# EAGLE design countdown timer (EAGLE 5.06)
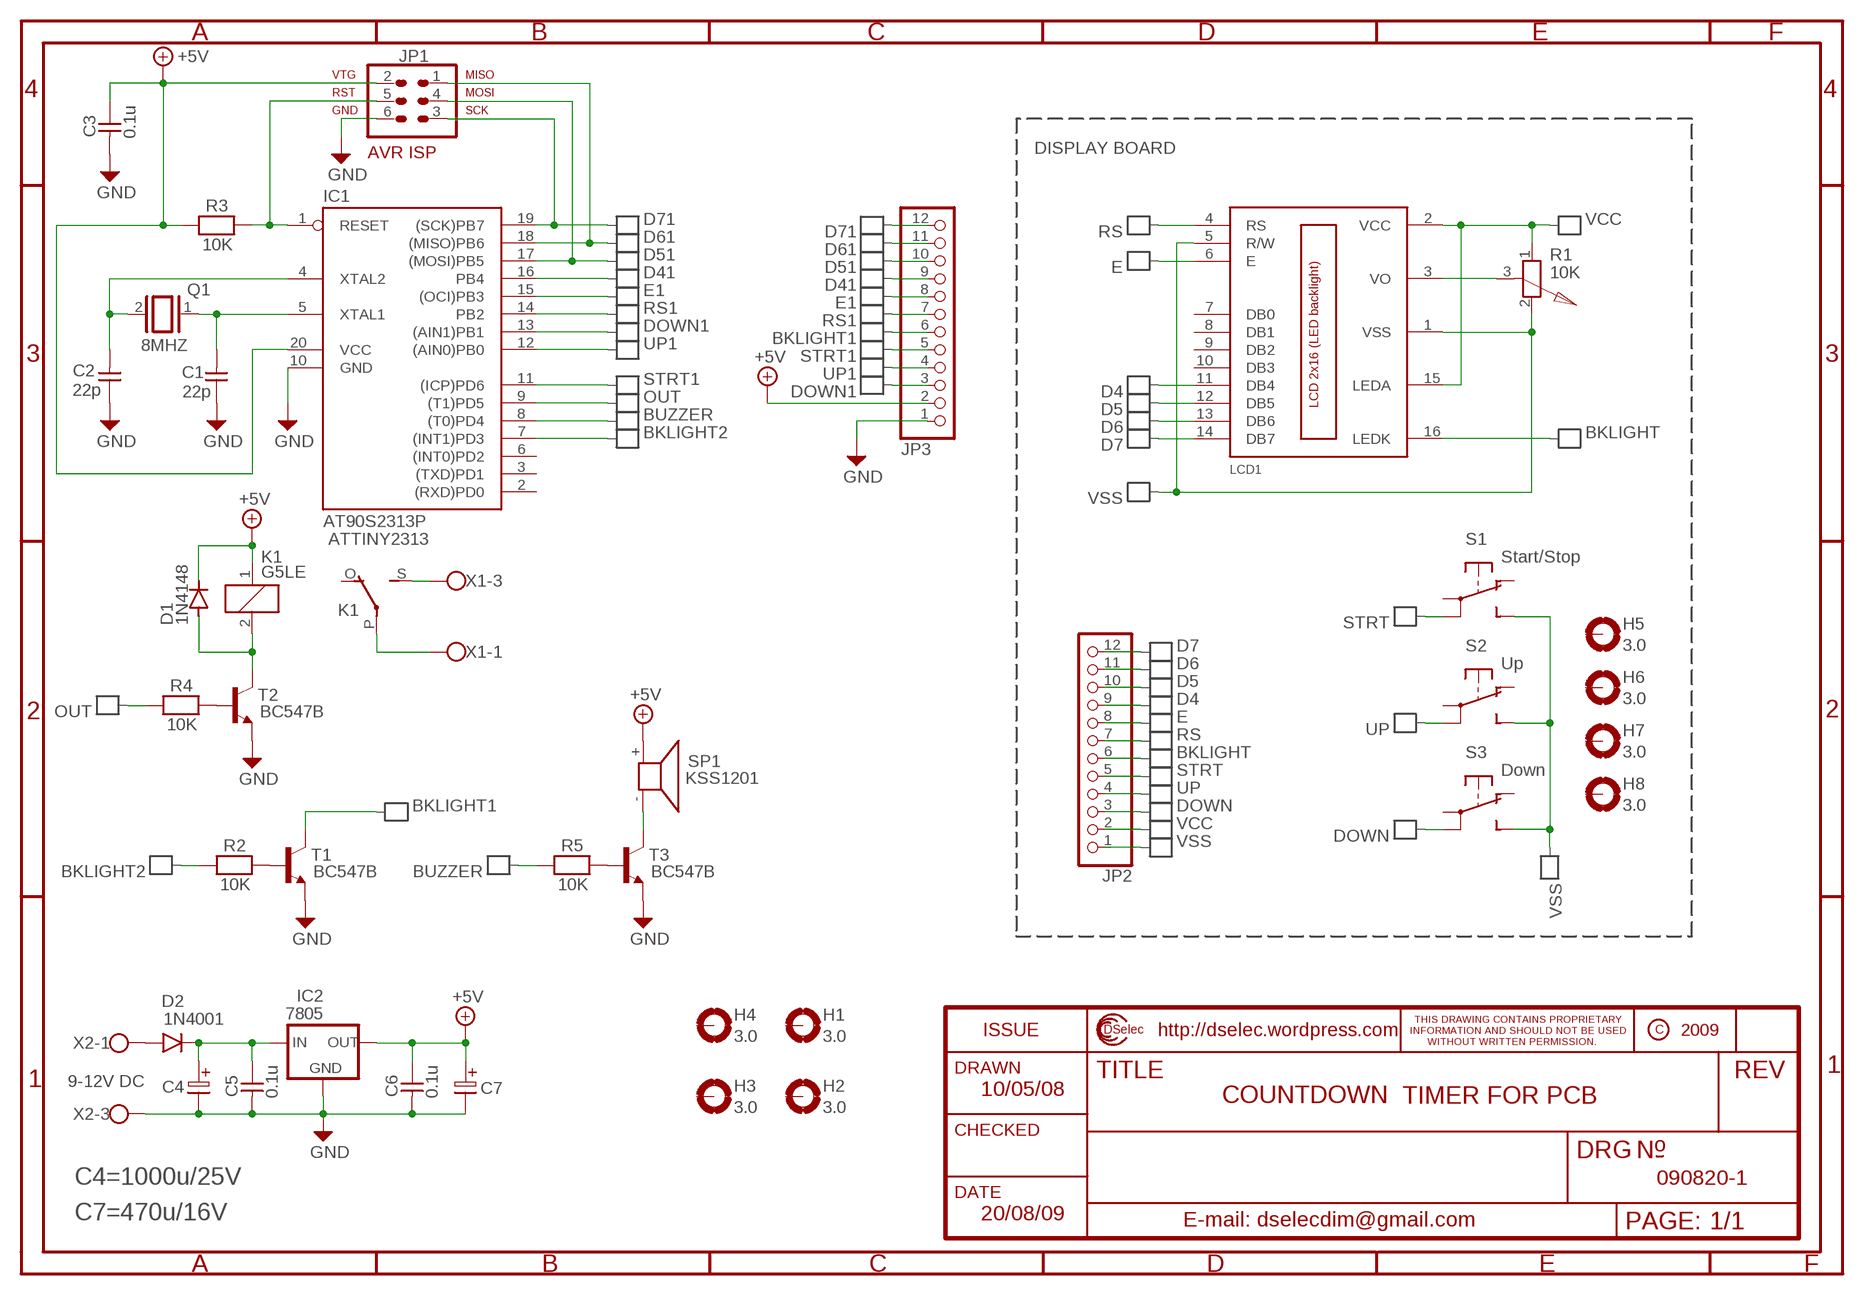
[diagram p0: schematic, sheet 1]

## Parts
C1  22p  CAPNP-5  [C-5]
C2  22p  CAPNP-5  [C-5]
C3  0.1u  CAPNP-5  [C-5]
C4  ELC-5  [ES-5]
C5  0.1u  CAPNP-5  [C-5]
C6  0.1u  CAPNP-5  [C-5]
C7  ELC-5  [ES-5]
D1  1N4148  [DO35-10]
D2  1N4001  [DO41-10]
H1  3.0  MOUNT-PAD-ROUND3.0  [3,0-PAD]
H2  3.0  MOUNT-PAD-ROUND3.0  [3,0-PAD]
H3  3.0  MOUNT-PAD-ROUND3.0  [3,0-PAD]
H4  3.0  MOUNT-PAD-ROUND3.0  [3,0-PAD]
H5  3.0  MOUNT-PAD-ROUND3.0  [3,0-PAD]
H6  3.0  MOUNT-PAD-ROUND3.0  [3,0-PAD]
H7  3.0  MOUNT-PAD-ROUND3.0  [3,0-PAD]
H8  3.0  MOUNT-PAD-ROUND3.0  [3,0-PAD]
IC1  AT90S2313P  [DIL20]
IC2  7805  78XXL  [78XXL]
JP1  AVR-ISP-6  [AVR-ISP-6]
JP2  PINHD-1X12  [1X12]
JP3  PINHD-1X12  [1X12]
K1  G5LE  [G5LE]
LCD1  LCD_2X16  [HY-1602F]
Q1  8MHZ  XTAL/S  [QS]
R1  10K  POT-L  [PT-10]
R2  10K  RESEU-10  [R-10]
R3  10K  RESEU-10  [R-10]
R4  10K  RESEU-10  [R-10]
R5  10K  RESEU-10  [R-10]
S1  Start/Stop  SRK  [SRK]
S2  Up  SRK  [SRK]
S3  Down  SRK  [SRK]
SP1  KSS1201  [KSS1201]
T1  BC547B  BC547B-NPN-TO92-EBC  [TO92-EBC]
T2  BC547B  BC547B-NPN-TO92-EBC  [TO92-EBC]
T3  BC547B  BC547B-NPN-TO92-EBC  [TO92-EBC]
X1  AK500/3  [AK500/3]
X2  AK500/3  [AK500/3]

## Nets
+5V: C3.1 C6.1 C7.1 D1.C IC1.20(VCC) IC2.OUT JP1.2 JP3.2 K1.1 R3.1 SP1.+
BKLIGHT: JP2.6 LCD1.16(LEDK)
BKLIGHT1: JP3.6 T1.C
BKLIGHT2: IC1.7((INT1)PD3) R2.1
BUZZER: IC1.8((T0)PD4) R5.1
D4: JP2.9 LCD1.11(DB4)
D5: JP2.10 LCD1.12(DB5)
D6: JP2.11 LCD1.13(DB6)
D7: JP2.12 LCD1.14(DB7)
D41: IC1.16(PB4) JP3.9
D51: IC1.17((MOSI)PB5) JP1.4 JP3.10
D61: IC1.18((MISO)PB6) JP1.1 JP3.11
D71: IC1.19((SCK)PB7) JP1.3 JP3.12
DOWN: JP2.3 S3.3(P)
DOWN1: IC1.13((AIN1)PB1) JP3.3
E: JP2.8 LCD1.6(E)
E1: IC1.15((OCI)PB3) JP3.8
GND: C1.1 C2.1 C3.2 C4.2 C5.2 C6.2 C7.2 IC1.10(GND) IC2.GND JP1.6 JP3.1 T1.E T2.E T3.E X2.3
N$1: R4.2 T2.B
N$2: C1.2 IC1.5(XTAL1) Q1.1
N$3: C2.2 IC1.4(XTAL2) Q1.2
N$4: IC1.1(RESET) JP1.5 R3.2
N$5: LCD1.3(VO) R1.3
N$6: C4.1 C5.1 D2.C(CATHODE) IC2.IN
N$7: R5.2 T3.B
N$8: D2.A(ANODE) X2.1
N$14: R2.2 T1.B
N$15: SP1.- T3.C
N$27: K1.S(2:S) X1.3
N$31: D1.A K1.2 T2.C
N$32: K1.P(2:P) X1.1
OUT: IC1.9((T1)PD5) R4.1
RS: JP2.7 LCD1.4(RS)
RS1: IC1.14(PB2) JP3.7
STRT: JP2.5 S1.3(P)
STRT1: IC1.11((ICP)PD6) JP3.5
UP: JP2.4 S2.3(P)
UP1: IC1.12((AIN0)PB0) JP3.4
VCC: JP2.2 LCD1.2(VCC) LCD1.15(LEDA) R1.1
VSS: JP2.1 LCD1.1(VSS) LCD1.5(R/W) R1.2 S1.1(S) S2.1(S) S3.1(S)
Unconnected: H1.B3,0(MOUNT) H2.B3,0(MOUNT) H3.B3,0(MOUNT) H4.B3,0(MOUNT) H5.B3,0(MOUNT) H6.B3,0(MOUNT) H7.B3,0(MOUNT) H8.B3,0(MOUNT) IC1.2((RXD)PD0) IC1.3((TXD)PD1) IC1.6((INT0)PD2) K1.O(2:O) LCD1.7(DB0) LCD1.8(DB1) LCD1.9(DB2) LCD1.10(DB3) S1.2(P) S1.4(O) S2.2(P) S2.4(O) S3.2(P) S3.4(O) X1.2 X2.2

## Notes on the sheet
- DISPLAY BOARD
- ATTINY2313
- 1N4001
- 9-12V DC
- 10/05/08
- COUNTDOWN | TIMER FOR PCB
- C4=1000u/25V | 090820-1
- C7=470u/16V | 20/08/09

## Library data of the parts
C1-C3 C5 C6 = discrete:CAPNP-5
C4 C7 = discrete:ELC-5
D1 = QuantumOptics:1N4148: 1N4148, fast small signal silicon, 80V 125mAavg trr=4nSmax
D2 = tango:1N4001: DIODE general purpose rectifier, 1 A
H1-H8 = holes:MOUNT-PAD-ROUND: MOUNTING PAD, round
IC1 = atmel:AT90S2313: MICROCONTROLLER 2 Kbytes FLASH 128 bytes SRAM 128 bytes EEPROM UART
IC2 = v-reg:78XXL: VOLTAGE REGULATOR
JP1 = atmel:AVR-ISP-6: AVR ISP-6 Serial Programming Header
JP2 JP3 = pinhead:PINHD-1X12: PIN HEADER
K1 = relay:G5LE: RELAY 1 x switch, 10 A/120 V AC, 8 A/30 V DC, Omron
LCD1 = lcd_2x16_led_backlight:LCD_2X16
Q1 = special:XTAL/S: CRYSTAL
R1 = discrete:POT-L
R2-R5 = discrete:RESEU-10
S1-S3 = switch-misc:SRK: SWITCH
SP1 = buzzer:KSS1201: SPEAKER Source: Schukat
T1-T3 = transistor:*-NPN-: NPN Transistror BF959 corrected 2008.03.06
X1 X2 = con-ptr500+:AK500/3: CONNECTOR

## Net classes
0 default: width 0.406 mm

## Board
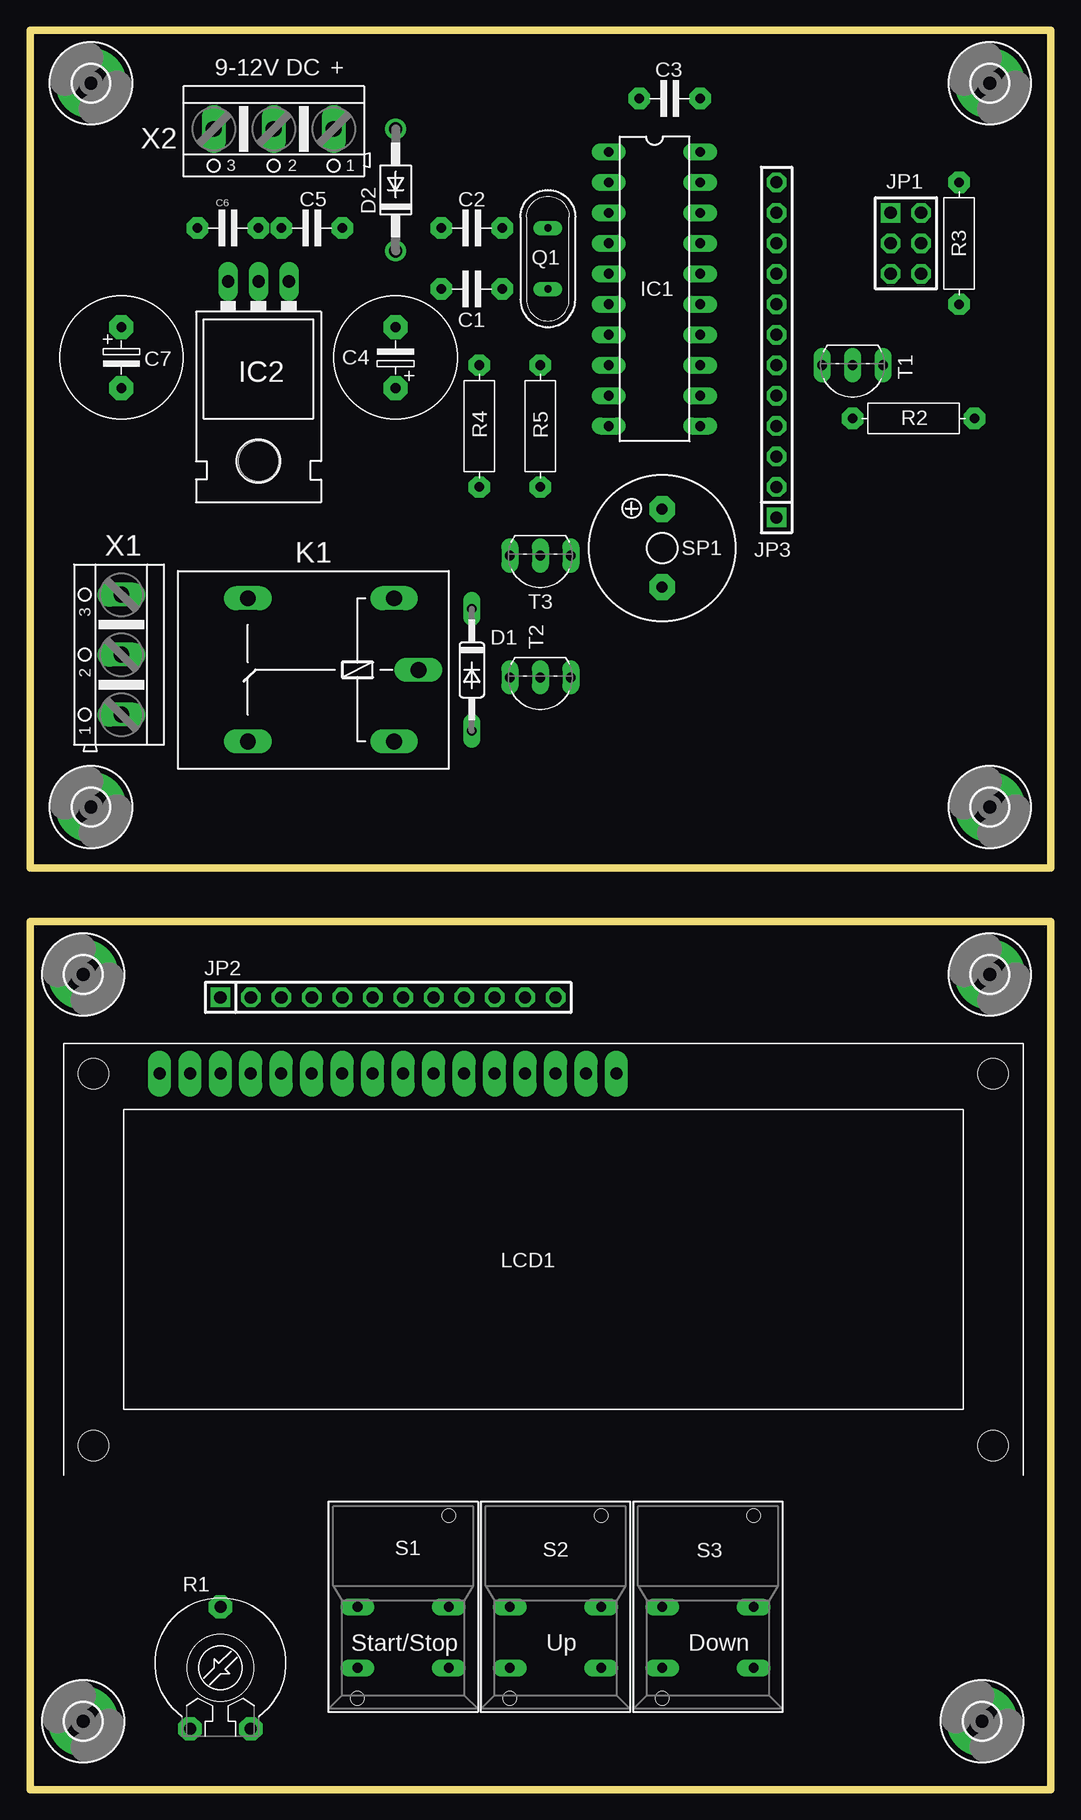
[diagram p1: board, top side]
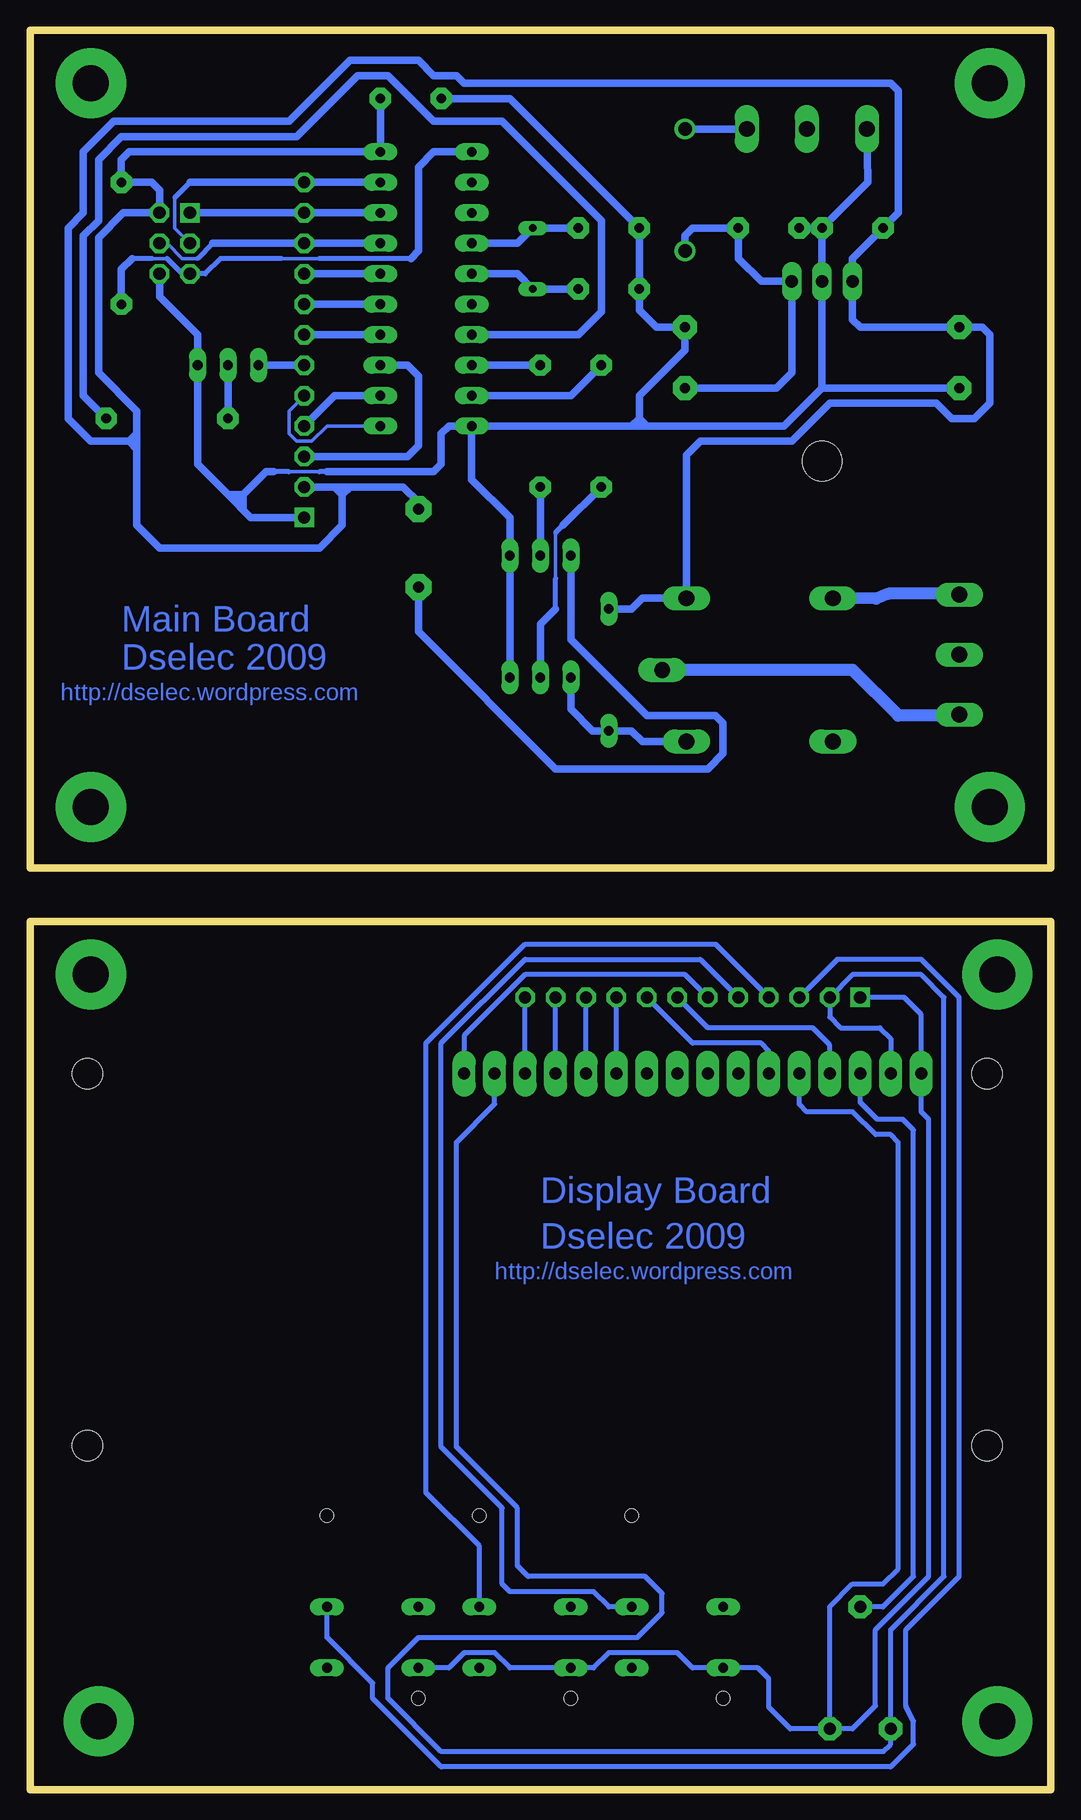
[diagram p2: board, bottom side, seen from below]

Size 85.09 x 146.69 mm. Coordinates in mm from the lower left corner, seen from the top.
Outline: 0,146.69 85.09,146.69 85.09,76.83 0,76.83 0,146.69
Outline: 85.09,72.39 0,72.39 0,0 85.09,0 85.09,72.39
Copper layers (1*16): Top 0.035mm / dielectric 1.5mm / Bottom 0.035mm
Design rules "lpkf *": minimum track width 10mil, minimum drill 25mil, track to track 10mil, track to pad 12mil, pad to pad 12mil, via to via 12mil, smd to smd 12mil, copper to edge 40mil, drill to drill 8mil, minimum pad ring 12mil, minimum via ring 12mil, stop-mask expansion 0mil, vias tented up to drill 0mil, thermal gap 10mil

### Footprints (pad centres in the part's own frame; a part is rotated, then mirrored left to right if it is on the bottom)
C-5 = drill 0.8 pad 1.778 octagon: 1 -2.54,0; 2 2.54,0
ES-5 = drill 0.813 pad 2.007 octagon: 1 -2.54,0; 2 2.54,0
DO35-10 = drill 0.813 long: A 5.08,0; C -5.08,0
DO41-10 = drill 1.118 round: A 5.08,0; C -5.08,0
3,0-PAD = drill 3 pad 5.842 round: B3,0 0,0
DIL20 = drill 0.813 long: 1 -11.43,-3.81; 2 -8.89,-3.81; 3 -6.35,-3.81; 4 -3.81,-3.81; 5 -1.27,-3.81; 6 1.27,-3.81; 7 3.81,-3.81; 8 6.35,-3.81; 9 8.89,-3.81; 10 11.43,-3.81; 11 11.43,3.81; 12 8.89,3.81; 13 6.35,3.81; 14 3.81,3.81; 15 1.27,3.81; 16 -1.27,3.81; 17 -3.81,3.81; 18 -6.35,3.81; 19 -8.89,3.81; 20 -11.43,3.81
78XXL = drill 1.016 long: GND 0,-3.81; IN -2.54,-3.81; OUT 2.54,-3.81 | hole 3.302: 0,11.176
AVR-ISP-6 = drill 1.016 square: 1 -2.54,-1.27 | drill 1.016 octagon: 2 -2.54,1.27; 3 0,-1.27; 4 0,1.27; 5 2.54,-1.27; 6 2.54,1.27
1X12 = drill 1.016 square: 1 -13.97,0 | drill 1.016 octagon: 2 -11.43,0; 3 -8.89,0; 4 -6.35,0; 5 -3.81,0; 6 -1.27,0; 7 1.27,0; 8 3.81,0; 9 6.35,0; 10 8.89,0; 11 11.43,0; 12 13.97,0
G5LE = drill 1.321 long: 1 -7.493,-5.969; 2 -7.493,5.969; O 4.699,5.969; P -9.525,0; S 4.699,-5.969
HY-1602F = drill 1 pad 1.93 long: 1 2.54,0; 2 5.08,0; 3 7.62,0; 4 10.16,0; 5 12.7,0; 6 15.24,0; 7 17.78,0; 8 20.32,0; 9 22.86,0; 10 25.4,0; 11 27.94,0; 12 30.48,0; 13 33.02,0; 14 35.56,0; 15 38.1,0; 16 40.64,0 | hole 2.5: -2.96,0; 72.04,0; -2.96,-31; 72.04,-31
QS = drill 0.61 long: 1 -2.54,0; 2 2.54,0
PT-10 = drill 1 pad 1.93 octagon: 1 -2.54,-5.08; 2 2.54,-5.08; 3 0,5.08
R-10 = drill 0.8 pad 1.778 octagon: 1 -5.08,0; 2 5.08,0
SRK = drill 0.813 long: 1 -3.81,-5.08; 2 -3.81,0; 3 3.81,0; 4 3.81,-5.08 | hole 1.118: -3.81,-7.62; 3.81,7.62
KSS1201 = drill 0.914 pad 2.159 octagon: + 3.251,0; - -3.251,0
TO92-EBC = drill 0.813 long: B 0,-1.27; C 2.54,-1.27; E -2.54,-1.27
AK500/3 = drill 1.321 long: 1 -5.004,0; 2 0,0; 3 5.004,0

### Placement (x,y rotation side)
C1  36.83,125.09 0 top
C2  36.83,130.18 0 top
C3  53.34,140.97 180 top
C4  30.48,119.38 90 top
C5  23.5,130.18 180 top
C6  16.51,130.18 0 top
C7  7.62,119.38 270 top
D1  36.83,93.34 270 top
D2  30.48,133.35 90 top
H1  5.08,142.24 270 top
H2  80.01,142.24 270 top
H3  5.08,81.92 270 top
H4  4.45,67.94 270 top
H5  80.01,81.92 270 top
H6  79.38,5.71 270 top
H7  4.45,5.71 270 top
H8  80.01,67.94 270 top
IC1  52.07,125.09 270 top
IC2  19.05,121.92 180 top
JP1  73.03,128.91 270 top
JP2  29.84,66.04 0 top
JP3  62.23,120.02 90 top
K1  22.86,93.34 180 top
LCD1  8.26,59.69 0 top
Q1  43.18,127.64 90 top
R1  15.88,10.16 0 top
R2  73.66,114.3 180 top
R3  77.47,128.91 270 top
R4  37.47,113.67 270 top
R5  42.55,113.67 270 top
S1  31.11,15.24 0 top
S2  43.81,15.24 0 top
S3  56.52,15.24 0 top
SP1  52.7,103.5 90 top
T1  68.58,117.47 180 top
T2  42.55,91.44 180 top
T3  42.55,101.6 180 top
X1  7.62,94.61 90 top
X2  20.32,138.43 180 top

### Tracks (layer width: path | path; a pad name or v marks a point on that pad's centre or on a via)
+5V
  Bottom 0.61: C3.1 IC1.20 76.83,136.53 77.47,135.89 R3.1 74.93,133.99 74.3,133.35 JP1.2 77.32,131.44 79.38,129.39 79.38,118.11 76.2,114.94 76.2,113.03 | 58.42,108.58 53.98,108.58 | 59.05,108.58 58.42,108.58 | 59.05,108.58 59.69,108.58 | 59.69,108.58 JP3.2 | 76.2,112.39 76.2,113.03 | 59.05,107.95 59.05,108.58 | 59.05,105.41 59.05,107.95 | 59.05,107.95 58.42,108.58 | 59.05,107.95 59.69,108.58 | D1.C 34.92,98.42 34.04,99.31 K1.1 30.35,111.25 29.21,112.39 21.59,112.39 18.41,115.57 9.53,115.57 8.26,114.3 6.35,114.3 5.08,115.57 5.08,121.28 5.71,121.92 C7.1 15.88,121.92 16.51,122.56 IC2.OUT 16.51,127.64 C6.1 12.7,131.44 12.7,141.6 13.34,142.24 48.9,142.24 49.53,142.88 51.44,142.88 52.7,144.15 58.42,144.15 63.5,139.06 78.11,139.06 80.64,136.53 80.64,131.44 81.92,130.18 81.92,114.3 80.01,112.39 76.83,112.39 | SP1.+ 52.7,107.31 53.98,108.58 | 59.05,108.58 53.98,108.58 | 59.05,105.41 59.05,108.58 | 59.05,105.41 60.96,103.5 74.3,103.5 76.2,105.41 76.2,111.76 | 76.2,112.39 76.2,111.76 | 76.83,112.39 76.2,112.39 | 76.83,112.39 76.2,113.03 | 76.83,112.39 76.2,111.76
BKLIGHT
  Bottom 0.406: JP2.6 30.48,67.94 43.81,67.94 48.9,62.87 LCD1.16
BKLIGHT1
  Bottom 0.61: JP3.6 T1.C
BKLIGHT2
  Bottom 0.61: IC1.7 39.37,121.28 37.47,123.19 37.47,130.81 45.72,139.06 51.44,139.06 55.24,142.88 57.78,142.88 62.87,137.79 77.47,137.79 79.38,135.89 79.38,130.81 80.64,129.54 80.64,116.2 R2.1
BUZZER
  Bottom 0.61: R5.1 IC1.8
D4
  Bottom 0.406: LCD1.11 JP2.9
D5
  Bottom 0.406: LCD1.12 JP2.10
D6
  Bottom 0.406: LCD1.13 JP2.11
D7
  Bottom 0.406: LCD1.14 JP2.12
D41
  Bottom 0.61: IC1.16 JP3.9
D51
  Bottom 0.305: JP1.4 73.66,128.91 72.39,127.64 71.12,127.64
  Bottom 0.406: 69.85,128.91 71.12,127.64
  Bottom 0.61: IC1.17 JP3.10 69.85,128.91
D61
  Bottom 0.61: IC1.18 JP3.11 JP1.1
D71
  Bottom 0.305: JP1.3 73.03,130.18 73.03,132.72
  Bottom 0.406: 71.75,133.99 73.03,132.72
  Bottom 0.61: IC1.19 JP3.12 71.75,133.99
DOWN
  Bottom 0.406: S3.3 60.33,12.7 56.52,8.89 56.52,7.62 50.8,1.91 13.34,1.91 11.43,3.81 11.43,5.71 12.06,6.99 12.06,13.34 7.62,17.78 7.62,66.04 10.79,69.22 17.78,69.22 JP2.3
DOWN1
  Bottom 0.61: IC1.13 53.6,118.75 52.7,117.85 52.7,112.02 53.6,111.12 JP3.3
E
  Bottom 0.406: JP2.8 29.84,62.23 24.13,62.23 23.5,61.59 LCD1.6
E1
  Bottom 0.61: IC1.15 JP3.8
GND
  Bottom 0.305: 60.96,109.86 63.5,109.86
  Bottom 0.406: 60.33,109.86 60.96,109.86 | 63.5,109.86 64.77,109.86
  Bottom 0.61: C3.2 45.09,140.97 C2.1 C1.1 34.29,123.34 32.87,121.92 C4.2 30.48,120.02 34.29,116.2 34.29,114.3 | C6.2 IC2.GND 19.05,116.84 | C6.2 C5.2 | C6.2 15.24,133.99 X2.3 | C7.2 19.05,116.84 | T2.E T3.E 45.09,106.05 48.26,109.22 IC1.10 | 34.29,113.67 34.92,113.67 | 34.92,113.67 IC1.10 | 19.05,116.84 22.23,113.67 33.66,113.67 | 33.66,113.67 34.29,113.67 | 34.29,113.67 34.29,114.3 | JP3.1 66.67,106.05 67.31,106.68 | 67.94,107.31 67.31,106.68 | 67.94,107.31 68.58,107.95 | 68.58,107.95 71.12,110.49 T1.E 71.12,121.28 74.3,124.46 JP1.6 | IC1.10 50.16,113.67 50.8,113.03 50.8,110.49 51.44,109.86 60.33,109.86 | 64.77,109.86 65.41,109.86 67.31,107.95 | 67.31,107.95 67.94,107.31 | 67.31,107.95 68.58,107.95 | 67.31,107.95 67.31,106.68 | 33.66,113.67 34.29,114.3 | 34.29,114.3 34.92,113.67
N$1
  Bottom 0.305: 41.27,100.97 41.27,104.78
  Bottom 0.406: 41.27,98.42 41.27,100.97 | 41.27,104.78 40.64,105.41
  Bottom 0.61: T2.B 42.55,97.16 41.27,98.42 | 40.64,105.41 R4.2
N$2
  Bottom 0.61: C1.2 Q1.1 44.45,126.36 IC1.5
N$3
  Bottom 0.61: C2.2 Q1.2 44.45,128.91 IC1.4
N$4
  Bottom 0.305: 60.96,127.64 64.14,127.64 | 73.66,127.64 74.93,127.64
  Bottom 0.406: 53.34,127.64 60.96,127.64 | 64.14,127.64 69.22,127.64 70.48,126.36 JP1.5 72.39,126.36 73.66,127.64 | 74.93,127.64 76.57,127.64
  Bottom 0.61: IC1.1 51.44,136.53 52.7,135.25 52.7,128.27 53.34,127.64 | 76.57,127.64 77.47,126.74 R3.2
N$5
  Bottom 0.406: R1.3 13.97,15.24 11.43,17.78 11.43,54.98 12.33,55.88 14.46,55.88 15.88,57.3 LCD1.3
N$6
  Bottom 0.61: C4.1 22.86,116.84 21.59,118.11 IC2.IN 24.13,125.73 26.04,127.64 C5.1 29.84,130.18 30.48,129.54 D2.C
N$7
  Bottom 0.61: T3.B R5.2
N$8
  Bottom 0.61: X2.1 D2.A
N$14
  Bottom 0.61: R2.2 T1.B
N$15
  Bottom 0.61: T3.C 40.01,95.89 33.66,89.53 27.94,89.53 27.3,88.9 27.3,86.36 28.57,85.09 41.27,85.09 52.7,96.52 SP1.-
N$27
  Bottom 0.305: X1.3 7.62,99.69
  Bottom 1.016: 7.62,99.69 13.52,99.7 14.55,99.28 K1.S
N$31
  Bottom 0.61: T2.C 40.01,90.06 38.21,88.27 D1.A 34.92,88.27 34.04,87.38 K1.2
N$32
  Bottom 1.016: K1.P 16.51,93.34 12.7,89.53 7.7,89.53 X1.1
OUT
  Bottom 0.61: IC1.9 40.01,116.2 R4.1
RS
  Bottom 0.406: JP2.7 28.57,63.5 19.84,63.5 18.41,62.08 LCD1.4
RS1
  Bottom 0.61: IC1.14 JP3.7
STRT
  Bottom 0.406: JP2.5 29.21,69.22 43.81,69.22 50.8,62.23 50.8,28.57 45.72,23.5 45.72,17.14 45.09,16.51 38.1,16.51 36.83,15.24 S1.3
STRT1
  Bottom 0.305: IC1.11 60.33,113.67 61.59,112.39 62.87,112.39 63.5,113.03 63.5,114.94 JP3.5
UP
  Bottom 0.406: S2.3 47.62,20.32 52.07,24.77 52.07,62.23 43.81,70.48 27.94,70.48 JP2.4
UP1
  Bottom 0.61: IC1.12 59.69,116.2 JP3.4
VCC
  Bottom 0.406: LCD1.2 13.34,62.6 14.23,63.5 17.52,63.5 18.41,64.4 JP2.2 16.51,67.94 10.79,67.94 8.89,66.04 8.89,17.78 13.34,13.34 R1.1 13.34,3.81 13.97,3.17 50.8,3.17 55.24,7.62 55.24,10.16 52.7,12.7 34.44,12.7 32.38,14.76 32.38,16.36 33.8,17.78 43.55,17.78 44.45,18.68 44.45,23.5 49.53,28.57 49.53,53.98 46.35,57.15 LCD1.15
VSS
  Bottom 0.406: JP2.1 12.21,66.04 10.79,64.62 LCD1.1 10.79,56.52 10.16,55.88 10.16,17.78 14.61,13.34 14.61,6.99 16.51,5.08 R1.2 | R1.2 21.7,5.08 23.5,6.88 23.5,9.26 24.39,10.16 S1.1 29.84,10.16 31.11,11.43 36.83,11.43 38.1,10.16 S2.1 45.09,10.16 46.35,11.43 48.9,11.43 50.16,10.16 S3.1 | LCD1.5 20.95,57.15 20.32,56.52 16.51,56.52 14.61,54.61 13.34,54.61 12.7,53.98 12.7,18.41 13.97,17.14 16.51,17.14 18.41,15.24 R1.2

### Text on the board
Bottom: Main Board | Dselec 2009 | http://dselec.wordpress.com | Display Board | Dselec 2009 | http://dselec.wordpress.com
tNames: 9-12V DC | + | Start/Stop | Up | Down